# EAGLE design Felderblock_Grundplatine (EAGLE 7.7.0)
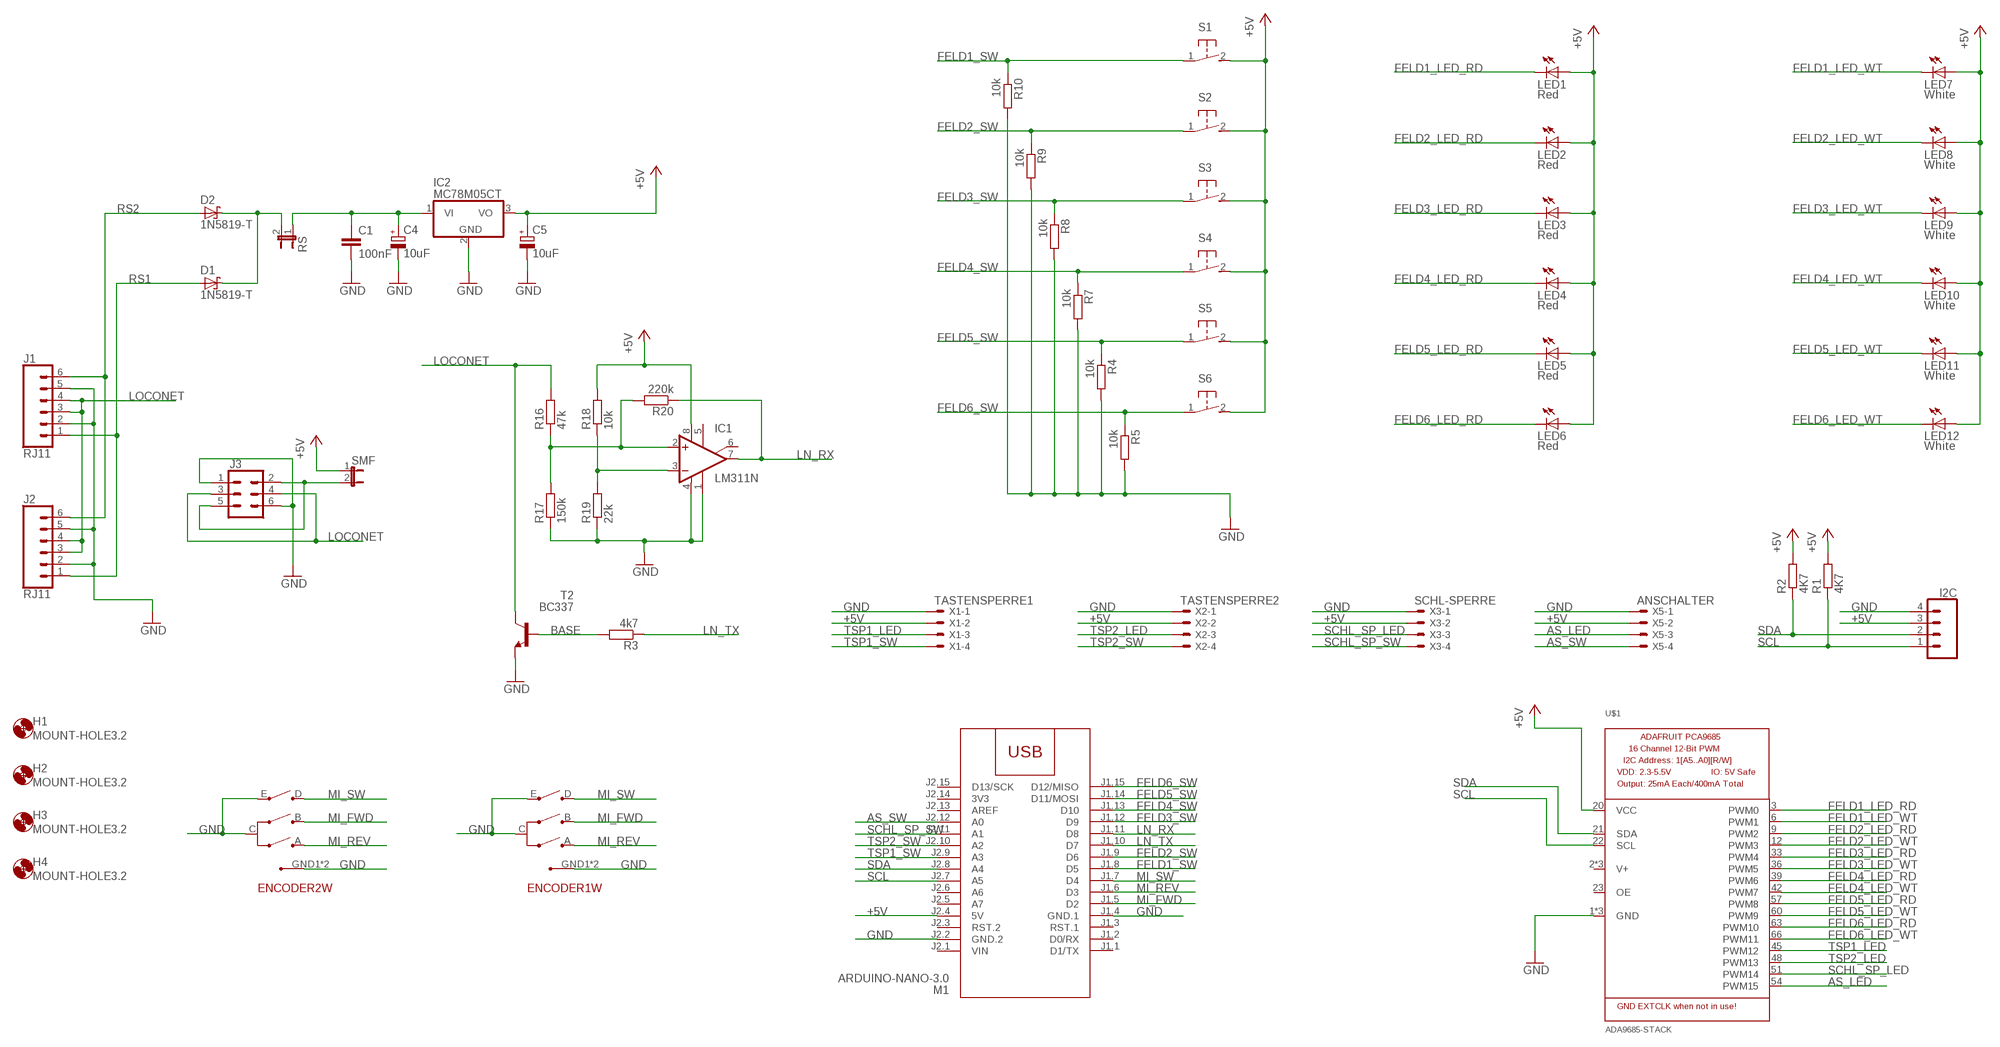
[diagram p0: schematic, sheet 1]

## Parts
C1  100nF  C-EU025-025X050  [C025-025X050]
C4  10uF  CPOL-EUE2-5  [E2-5]
C5  10uF  CPOL-EUE2-5  [E2-5]
D1  1N5819-T  [DO41-7.6]
D2  1N5819-T  [DO41-7.6]
ENCODER1  EC11B42AE  [EC11B42]
ENCODER2  EC11B42AE  [EC11B42]
H1  MOUNT-HOLE3.2  [3,2]
H2  MOUNT-HOLE3.2  [3,2]
H3  MOUNT-HOLE3.2  [3,2]
H4  MOUNT-HOLE3.2  [3,2]
I2C  CONN_04JST-PTH-VERT  [JST-4-PTH-VERT]
IC1  LM311N  [DIL08]
IC2  MC78M05CT  [TO220V]
J1  RJ11  RJ11-6  [RJ11-6]
J2  RJ11  RJ11-6  [RJ11-6]
J3  CONN_03X2SHROUD  [2X3-SHROUDED]
LED1  Red  LED3MM  [LED3MM]
LED2  Red  LED3MM  [LED3MM]
LED3  Red  LED3MM  [LED3MM]
LED4  Red  LED3MM  [LED3MM]
LED5  Red  LED3MM  [LED3MM]
LED6  Red  LED3MM  [LED3MM]
LED7  White  LED3MM  [LED3MM]
LED8  White  LED3MM  [LED3MM]
LED9  White  LED3MM  [LED3MM]
LED10  White  LED3MM  [LED3MM]
LED11  White  LED3MM  [LED3MM]
LED12  White  LED3MM  [LED3MM]
M1  ARDUINO-NANO-3.0  [ARDUINO-NANO-3.0]
R1  4K7  R-EU_0207/7  [0207/7]
R2  4K7  R-EU_0207/7  [0207/7]
R3  4k7  R-EU_0207/7  [0207/7]
R4  10k  R-EU_0207/7  [0207/7]
R5  10k  R-EU_0207/7  [0207/7]
R7  10k  R-EU_0207/7  [0207/7]
R8  10k  R-EU_0207/7  [0207/7]
R9  10k  R-EU_0207/7  [0207/7]
R10  10k  R-EU_0207/7  [0207/7]
R16  47k  R-EU_0207/7  [0207/7]
R17  150k  R-EU_0207/7  [0207/7]
R18  10k  R-EU_0207/7  [0207/7]
R19  22k  R-EU_0207/7  [0207/7]
R20  220k  R-EU_0207/7  [0207/7]
RS  JP1E  [JP1]
S1  31-XX  [B3F-31XX]
S2  31-XX  [B3F-31XX]
S3  31-XX  [B3F-31XX]
S4  31-XX  [B3F-31XX]
S5  31-XX  [B3F-31XX]
S6  31-XX  [B3F-31XX]
SMF  JP1E  [JP1]
T2  BC337  [TO92]
U$1  ADA9685-STACK  [ADA9685-STACK]
X1  TASTENSPERRE1  22-23-2041  [22-23-2041]
X2  TASTENSPERRE2  22-23-2041  [22-23-2041]
X3  SCHL-SPERRE  22-23-2041  [22-23-2041]
X5  ANSCHALTER  22-23-2041  [22-23-2041]

## Nets
+5V: C5.+ I2C.3 IC1.8(V+) IC2.3(VO) LED1.A LED2.A LED3.A LED4.A LED5.A LED6.A LED7.A LED8.A LED9.A LED10.A LED11.A LED12.A M1.J2.4(5V) R1.2 R2.2 R18.2 S1.2(S) S2.2(S) S3.2(S) S4.2(S) S5.2(S) S6.2(S) SMF.1 U$1.20(VCC) X1.2 X2.2 X3.2 X5.2
AS_LED: U$1.54(PWM15) X5.3
AS_SW: M1.J2.12(A0) X5.4
BASE: R3.2 T2.2(B)
FELD1_LED_RD: LED1.K(C) U$1.3(PWM0)
FELD1_LED_WT: LED7.K(C) U$1.6(PWM1)
FELD1_SW: M1.J1.8(D5) R10.1 S1.1(P)
FELD2_LED_RD: LED2.K(C) U$1.9(PWM2)
FELD2_LED_WT: LED8.K(C) U$1.12(PWM3)
FELD2_SW: M1.J1.9(D6) R9.1 S2.1(P)
FELD3_LED_RD: LED3.K(C) U$1.33(PWM4)
FELD3_LED_WT: LED9.K(C) U$1.36(PWM5)
FELD3_SW: M1.J1.12(D9) R8.1 S3.1(P)
FELD4_LED_RD: LED4.K(C) U$1.39(PWM6)
FELD4_LED_WT: LED10.K(C) U$1.42(PWM7)
FELD4_SW: M1.J1.13(D10) R7.1 S4.1(P)
FELD5_LED_RD: LED5.K(C) U$1.57(PWM8)
FELD5_LED_WT: LED11.K(C) U$1.60(PWM9)
FELD5_SW: M1.J1.14(D11/MOSI) R4.1 S5.1(P)
FELD6_LED_RD: LED6.K(C) U$1.63(PWM10)
FELD6_LED_WT: LED12.K(C) U$1.66(PWM11)
FELD6_SW: M1.J1.15(D12/MISO) R5.1 S6.1(P)
GND: C1.2 C4.- C5.- ENCODER1.C(W:C) ENCODER1.E ENCODER1.GND1(W:GND) ENCODER1.GND2(W:GND) ENCODER2.C(W:C) ENCODER2.E ENCODER2.GND1(W:GND) ENCODER2.GND2(W:GND) I2C.4 IC1.1(GND) IC1.4(V-) IC2.2(GND) J1.2 J1.5 J2.2 J2.5 J3.1 J3.6 M1.J1.4(GND.1) M1.J2.2(GND.2) R4.2 R5.2 R7.2 R8.2 R9.2 R10.2 R17.1 R19.1 T2.1(E) U$1.1(GND) U$1.24(GND) U$1.52(GND) X1.1 X2.1 X3.1 X5.1
LN_RX: IC1.7(OUT) M1.J1.11(D8) R20.1
LN_TX: M1.J1.10(D7) R3.1
LOCONET: J1.3 J1.4 J2.3 J2.4 J3.3 J3.4 R16.2 T2.3(C)
MI_FWD: ENCODER1.B(W:B) ENCODER2.B(W:B) M1.J1.5(D2)
MI_REV: ENCODER1.A(W:A) ENCODER2.A(W:A) M1.J1.6(D3)
MI_SW: ENCODER1.D ENCODER2.D M1.J1.7(D4)
N$5: IC1.2(+IN) R16.1 R17.2 R20.2
N$6: D1.C D2.C RS.2
N$7: C1.1 C4.+ IC2.1(VI) RS.1
N$8: IC1.3(-IN) R18.1 R19.2
N$10: J3.2 J3.5 SMF.2
RS1: D1.A J1.1 J2.1
RS2: D2.A J1.6 J2.6
SCHL_SP_LED: U$1.51(PWM14) X3.3
SCHL_SP_SW: M1.J2.11(A1) X3.4
SCL: I2C.1 M1.J2.7(A5) R1.1 U$1.22(SCL)
SDA: I2C.2 M1.J2.8(A4) R2.1 U$1.21(SDA)
TSP1_LED: U$1.45(PWM12) X1.3
TSP1_SW: M1.J2.9(A3) X1.4
TSP2_LED: U$1.48(PWM13) X2.3
TSP2_SW: M1.J2.10(A2) X2.4
Unconnected: IC1.5(ON) IC1.6(ON/STR) M1.J1.1(D1/TX) M1.J1.2(D0/RX) M1.J1.3(RST.1) M1.J2.3(RST.2) M1.J2.5(A7) M1.J2.6(A6) M1.J2.13(AREF) M1.J2.15(D13/SCK) U$1.2(V+) U$1.19(V+) U$1.23(OE) U$1.53(V+)

## Power pins joined to a net without a drawn wire
3V3: M1.J2.14(3V3)
VIN: M1.J2.1(VIN)

## Library data of the parts
C1 = resistor:C-EU: CAPACITOR, European symbol
C4 C5 = resistor:CPOL-EU: POLARIZED CAPACITOR, European symbol
D1 D2 = diode:1N581*: 1.0A SCHOTTKY BARRIER RECTIFIER Source: http://www.diodes.com/datasheets/ds23001.pdf
ENCODER1 ENCODER2 = alps:EC11B42AE: EC11B42 Encoder/switch
H1-H4 = holes:MOUNT-HOLE: MOUNTING HOLE with drill center marker
I2C = SparkFun-Connectors:CONN_04: Multi connection point. Often used as Generic Header-pin footprint for 0.1 inch spaced/style header connections On any of the 0.1 inch spaced packages, you can populate with these: Break Away Headers - Straight <https://www.sparkfun.com/products/116> (PRT-00116) Break Away Male Headers - Right Angle <https://www.sparkfun.com/products/553> (PRT-00553) Female Headers <https://www.sparkfun.com/products/115> (PRT-00115) Break Away Headers - Machine Pin <https://www.sparkfun.com/products/117> (PRT-00117) Break Away Female Headers - Swiss Machine Pin <https://www.sparkfun.com/products/743> (PRT-00743) For SCREWTERMINALS and SPRING TERMINALS visit here: Screw Terimnals on SparkFun.com <https://www.sparkfun.com/search/results?term=Screw+Terminals> (5mm/3.5mm/2.54mm spacing) This device is also useful as a general connection point to wire up your design to another part of your project. Our various solder wires solder well into these plated through hole pads. Hook-Up Wire - Assortment (Stranded, 22 AWG) <https://www.sparkfun.com/products/11375> (PRT-11375) Hook-Up Wire - Assortment (Solid Core, 22 AWG) <https://www.sparkfun.com/products/11367> (PRT-11367) View the entire wire category on our website here <https://www.sparkfun.com/categories/141> Special notes: Molex polarized connector foot print use with SKU : PRT-08231 with associated crimp pins and housings. 1MM SMD Version SKU: PRT-10208; PROD_ID: CONN-13251
IC1 = linear:LM311: COMPARATOR
IC2 = linear:MC78M: 500 mA Positive Voltage Regulators Source: Data sheet <http://www.onsemi.com/pub_link/Collateral/MC78M00-D.PDF>
J1 J2 = SparkFun-Connectors:RJ11-6: RJ11 Jack - 6 pin Commonly found on CAT3 devices and some Microchip programmers. Here is the connector we sell at SparkFun: RJ11 6-Pin Connector <https://www.sparkfun.com/products/132> (PRT-00132) Datasheet <http://www.sparkfun.com/datasheets/Prototyping/Connectors/RJ11-Datasheet.pdf> It is used on this SparkFun product: SparkFun Weather Shield <https://www.sparkfun.com/products/12081> (DEV-12081) Weather Meters <https://www.sparkfun.com/products/8942> (SEN-08942); PROD_ID: CONN-08590; SF_ID: PRT-00132
J3 = SparkFun-Connectors:CONN_03X2: Multi connection point. Often used as Generic Header-pin footprint for 0.1 inch spaced/style header connections You can populate with any combo of single row headers, but if you'd like an exact match, check these: Header - 2x3 (Male, 0.1") <https://www.sparkfun.com/products/12807> (PRT-12807) Header - 2x3 (Female, 0.1") <https://www.sparkfun.com/products/13010> (PRT-13010) 2x3 Pin Shrouded Header <https://www.sparkfun.com/products/10877> (PRT-10877) On any of the 0.1 inch spaced packages, you can populate with these: Break Away Headers - Straight <https://www.sparkfun.com/products/116> (PRT-00116) Break Away Male Headers - Right Angle <https://www.sparkfun.com/products/553> (PRT-00553) Female Headers <https://www.sparkfun.com/products/115> (PRT-00115) Break Away Headers - Machine Pin <https://www.sparkfun.com/products/117> (PRT-00117) Break Away Female Headers - Swiss Machine Pin <https://www.sparkfun.com/products/743> (PRT-00743) Special note: the shrouded connector mates well with our 3x2 ribbon cables: Ribbon Crimp Connector - 6-pin (2x3, Female) <https://www.sparkfun.com/products/10651> (PRT-10651) Ribbon Cable - 6 wire (15ft) <https://www.sparkfun.com/products/10646> (PRT-10646); PROD_ID: CONN-10681; SF_ID: PRT_10877
LED1-LED12 = led:LED: LED OSRAM: - CHIPLED LG R971, LG N971, LY N971, LG Q971, LY Q971, LO R971, LY R971 LH N974, LH R974 LS Q976, LO Q976, LY Q976 LO Q996 - Hyper CHIPLED LW Q18S LB Q993, LB Q99A, LB R99A - SideLED LS A670, LO A670, LY A670, LG A670, LP A670 LB A673, LV A673, LT A673, LW A673 LH A674 LY A675 LS A676, LA A676, LO A676, LY A676, LW A676 LS A679, LY A679, LG A679 - Hyper Micro SIDELED® LS Y876, LA Y876, LO Y876, LY Y876 LT Y87S - SmartLED LW L88C, LW L88S LB L89C, LB L89S, LG L890 LS L89K, LO L89K, LY L89K LS L896, LA L896, LO L896, LY L896 - TOPLED LS T670, LO T670, LY T670, LG T670, LP T670 LSG T670, LSP T670, LSY T670, LOP T670, LYG T670 LG T671, LOG T671, LSG T671 LB T673, LV T673, LT T673, LW T673 LH T674 LS T676, LA T676, LO T676, LY T676, LB T676, LH T676, LSB T676, LW T676 LB T67C, LV T67C, LT T67C, LS T67K, LO T67K, LY T67K, LW E67C LS E67B, LA E67B, LO E67B, LY E67B, LB E67C, LV E67C, LT E67C LW T67C LS T679, LY T679, LG T679 LS T770, LO T770, LY T770, LG T770, LP T770 LB T773, LV T773, LT T773, LW T773 LH T774 LS E675, LA E675, LY E675, LS T675 LS T776, LA T776, LO T776, LY T776, LB T776 LHGB T686 LT T68C, LB T68C - Hyper Mini TOPLED® LB M676 - Mini TOPLED Santana® LG M470 LS M47K, LO M47K, LY M47K Source: http://www.osram.convergy.de LUXEON: - LUMILED® LXK2-PW12-R00, LXK2-PW12-S00, LXK2-PW14-U00, LXK2-PW14-V00 LXK2-PM12-R00, LXK2-PM12-S00, LXK2-PM14-U00 LXK2-PE12-Q00, LXK2-PE12-R00, LXK2-PE12-S00, LXK2-PE14-T00, LXK2-PE14-U00 LXK2-PB12-K00, LXK2-PB12-L00, LXK2-PB12-M00, LXK2-PB14-N00, LXK2-PB14-P00, LXK2-PB14-Q00 LXK2-PR12-L00, LXK2-PR12-M00, LXK2-PR14-Q00, LXK2-PR14-R00 LXK2-PD12-Q00, LXK2-PD12-R00, LXK2-PD12-S00 LXK2-PH12-R00, LXK2-PH12-S00 LXK2-PL12-P00, LXK2-PL12-Q00, LXK2-PL12-R00 Source: www.luxeon.com KINGBRIGHT: KA-3528ASYC Source: www.kingbright.com
M1 = diy-modules:ARDUINO-NANO-3.0: Arduino Nano 3.0
R1-R5 R7-R10 R16-R20 = resistor:R-EU_: RESISTOR, European symbol
RS SMF = jumper:JP1E: JUMPER
S1-S6 = adafruit:31-XX: OMRON SWITCH Now with beefier pads!
T2 = transistor:BC337: NPN TRANSISTOR
U$1 = ada9685:ADA9685-STACK
X1-X3 X5 = con-molex:22-23-2041: .100" (2.54mm) Center Header - 4 Pin; MF: MOLEX; MPN: 22-23-2041; OC_FARNELL: 1462920; OC_NEWARK: 38C0355

## Board
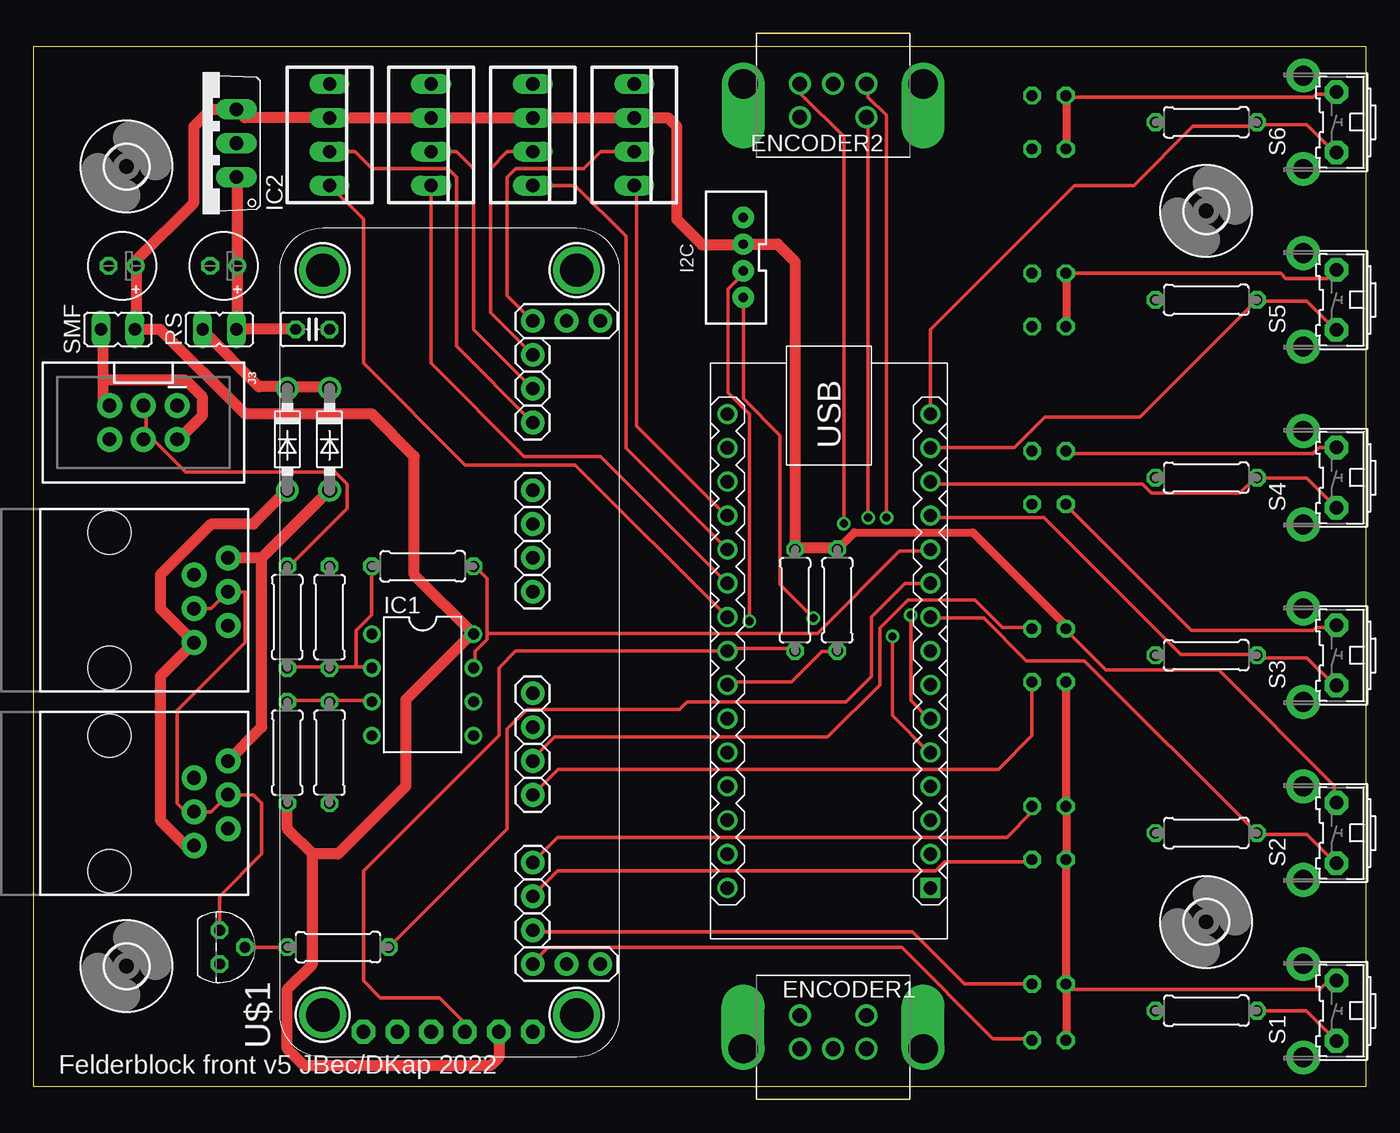
[diagram p1: board, top side]
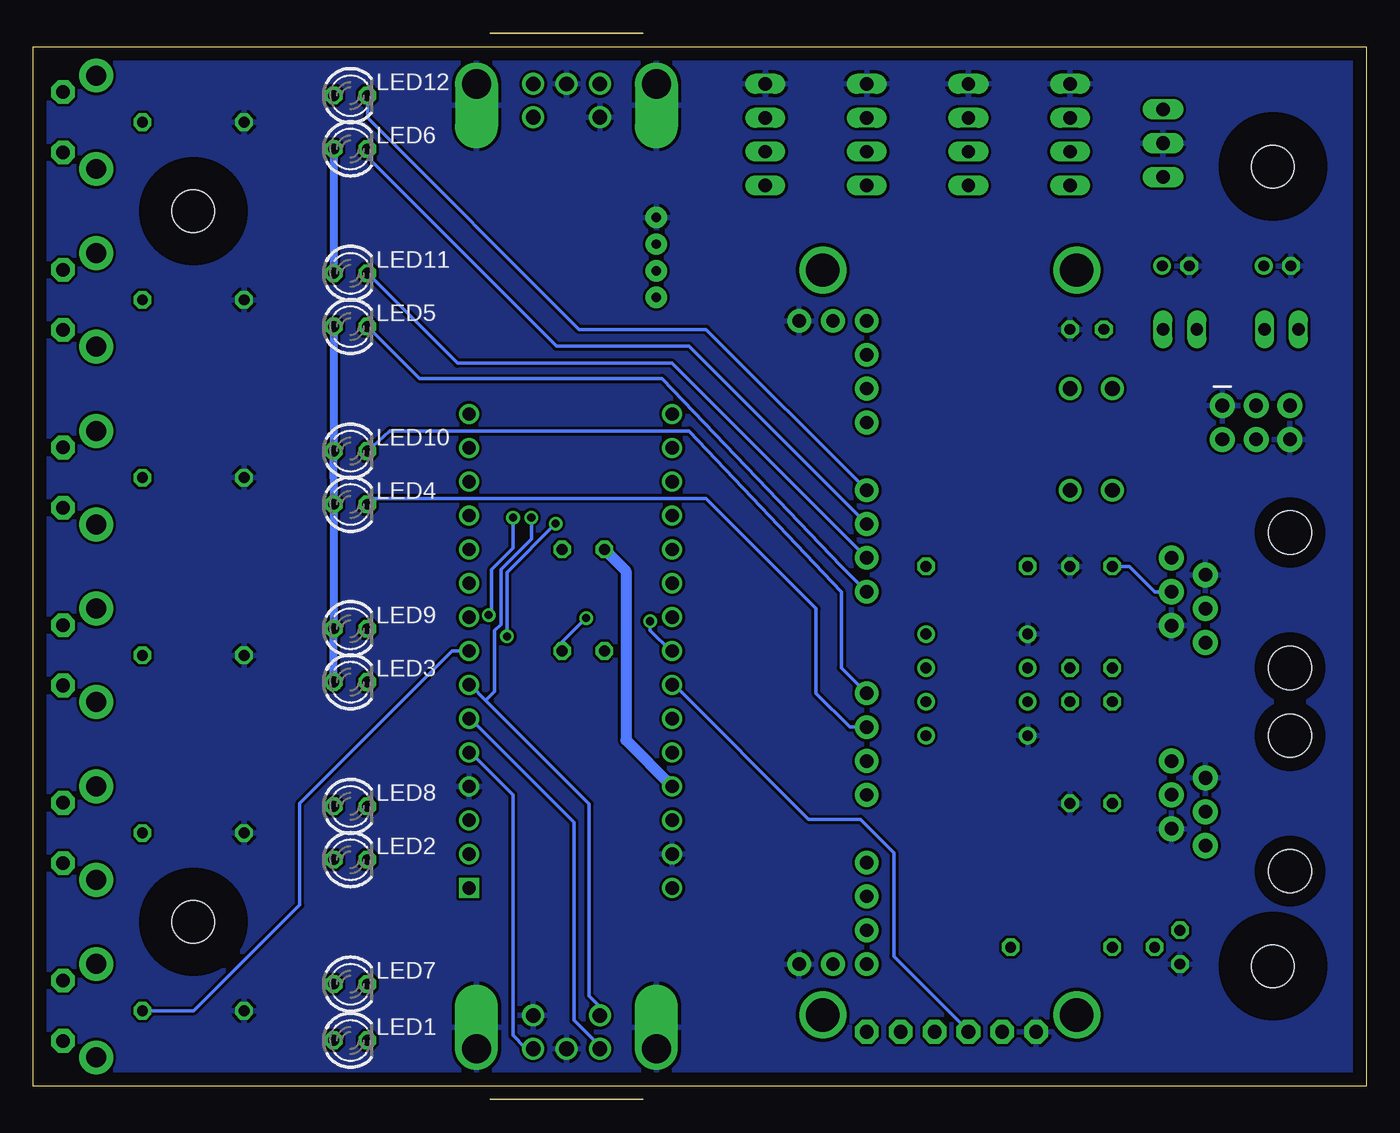
[diagram p2: board, bottom side, seen from below]

Size 100 x 78 mm. Coordinates in mm from the lower left corner, seen from the top.
Outline: 0,0 100,0 100,78 0,78 0,0
Copper layers (1*16): Top 0.035mm / dielectric 1.5mm / Bottom 0.035mm
Design rules "default": minimum track width 10mil, minimum drill 24mil, track to track 8mil, track to pad 8mil, pad to pad 8mil, via to via 8mil, smd to smd 8mil, copper to edge 40mil, drill to drill 8mil, minimum pad ring 10mil, minimum via ring 8mil, stop-mask expansion 4mil, vias tented up to drill 0mil, thermal gap 10mil

### Footprints (pad centres in the part's own frame; a part is rotated, then mirrored left to right if it is on the bottom)
C025-025X050 = drill 0.813 octagon: 1 -1.27,0; 2 1.27,0
E2-5 = drill 0.813 pad 1.27: + -1.016,0 | drill 0.813 pad 1.27 octagon: - 1.016,0
DO41-7.6 = drill 1.1 pad 1.7: A 3.81,0; C -3.81,0
EC11B42 = drill 1.1: A -2.5,0; B 2.5,0; C 0,0; D -2.5,2.5; E 2.5,2.5 | drill 2.2 offset: GND1 -6.75,0; GND2 6.75,0
3,2 = hole 3.2: 0,0
JST-4-PTH-VERT = drill 0.7 pad 1.6: 1 -3,-0.55; 2 -1,-0.55; 3 1,-0.55; 4 3,-0.55
DIL08 = drill 0.813 pad 1.27: 1 -3.81,-3.81; 2 -1.27,-3.81; 3 1.27,-3.81; 4 3.81,-3.81; 5 3.81,3.81; 6 1.27,3.81; 7 -1.27,3.81; 8 -3.81,3.81
TO220V = drill 1.016 long: 1 -2.54,-2.54; 2 0,-2.54; 3 2.54,-2.54
RJ11-6 = drill 1.016 pad 1.88: 1 -3.175,8.89; 2 -1.905,6.35; 3 -0.635,8.89; 4 0.635,6.35; 5 1.905,8.89; 6 3.175,6.35 | hole 3.251: -5.08,0; 5.08,0
2X3-SHROUDED = drill 1.016 pad 1.88: 1 -1.27,2.54; 2 1.27,2.54; 3 -1.27,0; 4 1.27,0; 5 -1.27,-2.54; 6 1.27,-2.54
LED3MM = drill 0.813 octagon: A -1.27,0; K 1.27,0
ARDUINO-NANO-3.0 = drill 1 square: J1.1 17.78,7.62 | drill 1: J1.2 15.24,7.62; J1.3 12.7,7.62; J1.4 10.16,7.62; J1.5 7.62,7.62; J1.6 5.08,7.62; J1.7 2.54,7.62; J1.8 0,7.62; J1.9 -2.54,7.62; J1.10 -5.08,7.62; J1.11 -7.62,7.62; J1.12 -10.16,7.62; J1.13 -12.7,7.62; J1.14 -15.24,7.62; J1.15 -17.78,7.62; J2.1 17.78,-7.62; J2.2 15.24,-7.62; J2.3 12.7,-7.62; J2.4 10.16,-7.62; J2.5 7.62,-7.62; J2.6 5.08,-7.62; J2.7 2.54,-7.62; J2.8 0,-7.62; J2.9 -2.54,-7.62; J2.10 -5.08,-7.62; J2.11 -7.62,-7.62; J2.12 -10.16,-7.62; J2.13 -12.7,-7.62; J2.14 -15.24,-7.62; J2.15 -17.78,-7.62
0207/7 = drill 0.813 octagon: 1 -3.81,0; 2 3.81,0
JP1 = drill 0.914 long: 1 0,-1.27; 2 0,1.27
B3F-31XX = drill 1.016 pad 1.778 octagon: 1 -2.261,-1.245; 2 2.261,-1.245 | drill 1.499 pad 2.54: 3 -3.505,1.245; 4 3.505,1.245
TO92 = drill 0.813 octagon: 1 1.27,0; 2 0,1.905; 3 -1.27,0
ADA9685-STACK = drill 1 pad 1.778: 1 5.08,-5.08; 2 5.08,-2.54; 3 5.08,0; 6 7.62,0; 9 10.16,0; 12 12.7,0; 33 17.78,0; 36 20.32,0; 39 22.86,0; 42 25.4,0; 45 45.72,0; 48 48.26,0; 51 50.8,0; 52 53.34,-5.08; 53 53.34,-2.54; 54 53.34,0; 57 33.02,0; 60 35.56,0; 63 38.1,0; 66 40.64,0 | drill 1.016 pad 1.778 octagon: 19 0,0; 20 0,2.54; 21 0,5.08; 22 0,7.62; 23 0,10.16; 24 0,12.7 | drill 2.5 pad 3.2: P$1 1.27,-3.302; P$2 1.27,15.748; P$3 57.15,-3.302; P$4 57.15,15.748
22-23-2041 = drill 1 long: 1 -3.81,0; 2 -1.27,0; 3 1.27,0; 4 3.81,0

### Placement (x,y rotation side)
C1  20.95,56.78 0 top
C4  14.29,61.55 180 top
C5  6.67,61.55 180 top
D1  22.23,48.53 270 top
D2  19.05,48.53 270 top
ENCODER1  60,2.81 0 top
ENCODER2  60,75.2 180 top
H1  88,12.33 0 top
H2  7,9 0 top
H3  7,69 0 top
H4  88,65.66 0 top
I2C  52.7,62.18 90 top
IC1  29.21,30.11 270 top
IC2  12.7,70.75 90 top
J1  5.71,21.23 270 top
J2  5.71,36.47 270 top
J3  8.26,49.8 270 top
LED1  76.2,3.44 0 bottom
LED2  76.2,17 0 bottom
LED3  76.2,30.33 0 bottom
LED4  76.2,43.66 0 bottom
LED5  76.2,57 0 bottom
LED6  76.2,70.33 0 bottom
LED7  76.2,7.66 0 bottom
LED8  76.2,21 0 bottom
LED9  76.2,34.33 0 bottom
LED10  76.2,47.66 0 bottom
LED11  76.2,61 0 bottom
LED12  76.2,74.33 0 bottom
M1  59.69,32.66 270 top
R1  60.33,36.47 90 top
R2  57.15,36.47 90 top
R3  22.86,10.43 180 top
R4  88,59 180 top
R5  88,72.33 180 top
R7  88,45.66 180 top
R8  88,32.33 180 top
R9  88,19 180 top
R10  88,5.66 180 top
R16  19.05,35.2 90 top
R17  22.23,35.2 270 top
R18  19.05,25.04 270 top
R19  22.23,25.04 90 top
R20  29.21,39.01 180 top
RS  13.97,56.78 90 top
S1  96.52,5.66 90 top
S2  96.52,19 90 top
S3  96.52,32.33 90 top
S4  96.52,45.66 90 top
S5  96.52,59 90 top
S6  96.52,72.33 90 top
SMF  6.35,56.78 90 top
T2  13.97,10.43 270 top
U$1  37.47,4.08 90 top
X1  22.23,71.39 270 top
X2  29.84,71.39 270 top
X3  37.47,71.39 270 top
X5  45.09,71.39 270 top

### Tracks (layer width: path | path; a pad name or v marks a point on that pad's centre or on a via)
+5V  (via drill 0.6)
  Top 0.254: 7.77,61.41 C5.+ | 7.77,56.84 SMF.1 7.77,56.61 | 32.92,33.98 IC1.8 | 77.5,17.06 LED2.A 77.5,16.83 | 77.5,20.95 LED8.A | 77.5,3.57 LED1.A | 77.5,7.46 LED7.A | 77.5,7.69 LED7.A | S2.2 97.61,21.4 97.61,22.55 88.92,31.23 80.47,31.23 77.5,34.2 LED9.A 77.47,34.56 | 77.5,70.55 LED6.A | S6.2 97.61,74.44 96.24,74.44 96.01,74.21 77.5,74.21 LED12.A | 77.5,57.06 LED5.A | 77.5,60.95 LED11.A 93.58,61 93.98,60.59 97.1,60.59 S5.2 | S3.2 97.61,34.43 96.24,34.43 96.01,34.2 86.87,34.2 77.5,43.58 LED4.A | S4.2 97.61,47.92 96.47,47.92 96.01,47.46 77.67,47.46 LED10.A | 60.12,40.38 R1.2 | 57.15,40.38 R2.2 | S1.2 97.19,7.92 96.52,7.26 77.88,7.26 LED7.A
  Top 0.61: 77.5,20.95 77.5,17.06 | 77.5,7.46 77.5,3.57 | 77.5,7.69 77.5,16.83 | 77.5,74.21 77.5,70.55 | 77.5,60.95 77.5,57.06 | v77.47,30.29 LED8.A | 77.47,34.56 70.48,41.55 61.59,41.55 R1.2 | C5.+ 7.68,61.93
  Top 0.813: 7.77,56.84 7.77,61.41 | U$1.20 34.92,2.17 34.29,1.54 20.32,1.54 19.05,2.81 19.05,7.26 20.95,9.16 20.95,17.41 | 20.95,17.41 19.05,19.32 R18.2 | 32.92,33.98 27.94,29 27.94,22.5 22.86,17.41 20.95,17.41 | IC1.8 28.57,38.37 28.57,47.26 25.4,50.44 15.88,50.44 9.53,56.78 SMF.1 | 7.68,61.93 12.06,66.31 12.06,72.03 13.34,73.3 IC2.3 15.88,72.66 X1.2 X2.2 X3.2 X5.2 47.62,72.66 48.26,72.03 48.26,65.04 50.16,63.14 53.21,63.14 I2C.3 55.83,63.18 57.15,61.87 57.15,40.38 60.12,40.38
  Bottom 0.254: 77.47,30.34 77.5,30.32 v77.47,30.29 | LED3.A 77.5,30.55 77.47,30.55 | 77.5,47.46 77.27,47.46 LED10.A
  Bottom 0.61: LED6.A LED11.A | 77.5,47.46 LED4.A LED9.A 77.47,30.55 77.47,30.34 | LED5.A LED10.A
  Bottom 0.813: M1.J2.4 55.55,25.98 55.55,38.67 R2.2
AS_LED
  Top 0.254: U$1.54 35.56,59.33 35.56,68.22 36.2,68.85 41.27,68.85 42.55,70.12 X5.3
AS_SW
  Top 0.254: X5.4 45.26,67.58 45.26,49.52 51.89,42.89 M1.J2.12
BASE
  Top 0.254: R3.2 T2.2
FELD1_LED_RD
  Top 0.254: LED1.K 74.75,3.57 72.01,3.57 65.15,10.43 38.63,10.43 37.49,9.29 U$1.3
FELD1_LED_WT
  Top 0.254: LED7.K 74.75,7.69 69.85,7.69 65.96,11.57 37.49,11.57 U$1.6
FELD1_SW
  Top 0.254: R10.1 95.5,5.66 S1.1
  Bottom 0.254: R10.1 87.95,5.66 80.01,13.61 80.01,21.23 68.58,32.66 M1.J1.8
FELD2_LED_RD
  Top 0.254: LED2.K 74.75,16.83 68.35,16.83 67.67,16.14 39.32,16.14 37.49,14.32 U$1.9
FELD2_LED_WT
  Top 0.254: LED8.K 74.93,20.59 73.03,18.68 39.34,18.68 37.49,16.83 U$1.12
FELD2_SW
  Top 0.254: S2.1 97.61,16.83 95.56,18.89 91.9,18.89 R9.1 91.67,19.12 78.87,31.92 74.52,31.92 71.32,35.12 67.44,35.12 M1.J1.9
FELD3_LED_RD
  Top 0.254: U$1.33 39.37,23.77 72.39,23.77 74.93,26.3 LED3.K
FELD3_LED_WT
  Top 0.254: LED9.K 74.75,34.43 72.69,34.43 70.64,36.49 65.61,36.49 63.5,34.38 63.5,30.11 59.59,26.2 39.09,26.2 37.49,24.6 U$1.36
FELD3_SW
  Top 0.254: S3.1 97.61,30.09 95.56,32.15 91.9,32.15 R8.1 91.67,32.38 86.11,32.38 75.82,42.66 67.44,42.66 M1.J1.12
FELD4_LED_RD
  Bottom 0.254: U$1.39 38.73,26.94 41.27,29.48 41.27,35.83 49.53,44.09 74.5,44.09 LED4.K
FELD4_LED_WT
  Bottom 0.254: LED10.K 73.26,49.16 50.8,49.16 39.37,37.1 39.37,31.38 U$1.42
FELD4_SW
  Top 0.254: S4.1 97.61,43.58 95.56,45.63 91.9,45.63 R7.1 91.67,45.63 90.53,44.49 83.9,44.49 83.21,45.18 67.44,45.18 M1.J1.13
FELD5_LED_RD
  Bottom 0.254: 37.49,36.95 U$1.57 39.37,39.01 52.83,53.1 71.03,53.1 LED5.K
FELD5_LED_WT
  Bottom 0.254: U$1.60 52.07,54.24 68.17,54.24 LED11.K
FELD5_SW
  Top 0.254: S5.1 97.61,56.84 95.56,58.89 91.9,58.89 R4.1 83.02,50.21 75.89,50.21 73.61,47.92 67.44,47.92 M1.J1.14
FELD6_LED_RD
  Bottom 0.254: U$1.63 50.8,55.52 60.75,55.52 74.93,69.69 LED6.K
FELD6_LED_WT
  Bottom 0.254: U$1.66 49.53,56.78 59.05,56.78 74.93,72.66 LED12.K
FELD6_SW
  Top 0.254: S6.1 97.61,70.09 95.56,72.15 91.9,72.15 R5.1 91.5,72.03 87,72.03 82.55,67.58 78.11,67.58 67.31,56.78 M1.J1.15
GND
  pour Bottom: 0,0.27 100.33,0.27 100.33,77.74 0,77.74
LN_RX
  Top 0.254: 34.06,33.98 34.06,38.09 33.15,39.01 R20.1 | 34.06,33.98 34.06,33.52 33.15,32.6 33.15,31.46 IC1.7 | 34.06,33.98 58.83,33.98 65,40.15 67.21,40.15 M1.J1.11
LN_TX
  Top 0.254: R3.1 35.56,19.32 35.56,26.79 37.03,28.26 48.46,28.26 49.05,28.84 60.96,28.84 62.87,30.75 62.87,35.2 65.41,37.73 M1.J1.10
  Bottom 0.254: 26.75,10.43 R3.1
LOCONET
  Top 0.254: J3.3 8.46,50.89 8.46,48.61 J3.4 8.46,48.38 9.14,48.38 11.43,46.09 22.63,46.09 23.55,45.18 23.55,43.35 19.2,39.01 R16.2 | J2.4 13.34,35.83 J2.3 15.88,37.1 15.88,33.29 10.79,28.21 10.79,21.23 11.43,20.59 J1.4 13.34,20.59 J1.3 16.51,21.86 17.14,21.23 17.14,17.41 13.97,14.24 T2.3
  Bottom 0.254: R16.2 17.78,39.01 15.88,37.1 J2.3
MI_FWD  (via drill 0.61)
  Top 0.254: v60.81,42.2 60.81,71.24 57.61,74.44 57.61,75.12 ENCODER2.B | v64.47,33.75 64.47,27.8 67.21,25.06 M1.J1.5
  Bottom 0.254: M1.J1.5 67.21,24.83 66.98,24.83 64.01,21.86 64.01,3.8 63.09,2.89 62.64,2.89 ENCODER1.B | v60.81,42.2 64.47,38.55 v64.47,33.75
MI_REV  (via drill 0.61)
  Top 0.254: v64.01,42.66 64.01,72.84 62.64,74.21 62.64,75.12 ENCODER2.A | v65.84,35.35 65.84,28.95 67.21,27.57 M1.J1.6
  Bottom 0.254: M1.J1.6 67.21,27.57 59.44,19.8 59.44,4.94 57.38,2.89 ENCODER1.A | v64.01,42.66 64.01,40.38 65.61,38.78 65.61,35.58 v65.84,35.35
MI_SW  (via drill 0.61)
  Top 0.254: v62.64,42.66 62.64,72.61 ENCODER2.D
  Bottom 0.254: 66.06,28.95 58.29,21.17 58.29,6.77 57.61,6.09 57.61,5.4 ENCODER1.D | 66.06,28.95 67.21,30.09 M1.J1.7 | v62.64,42.66 62.64,41.06 64.92,38.78 64.92,34.66 65.38,34.2 65.38,29.63 66.06,28.95
N$5
  Top 0.254: R16.1 19.2,31.46 22.17,31.46 R17.2 22.4,31.46 24.23,31.46 | 24.23,31.46 25.38,31.46 IC1.2 | 24.23,31.46 24.23,34.2 25.38,35.35 25.38,39.01 R20.2
N$6
  Top 0.254: 12.8,56.61 RS.2 | 18.97,52.49 D2.C 19.2,52.49 | 22.17,52.49 D1.C
  Top 0.813: 12.8,56.61 16.92,52.49 18.97,52.49 | 19.2,52.49 22.17,52.49
N$7
  Top 0.254: 19.66,56.84 C1.1 | 15.32,61.41 C4.+ 15.32,61.64 | 15.32,56.84 RS.1 | 15.32,68.04 IC2.1
  Top 0.813: 19.66,56.84 15.32,56.84 15.32,61.41 | 15.32,61.64 15.32,68.04
N$8
  Top 0.254: R18.1 19.2,28.95 22.17,28.95 R19.2 22.4,28.95 25.38,28.95 IC1.3
N$10
  Top 0.254: 5.26,56.61 SMF.2 | 5.71,51.12 J3.5 | 10.97,48.61 J3.2
  Top 0.813: 5.26,52.98 5.26,51.58 5.71,51.12 | 5.26,52.98 5.26,56.61 | 10.97,48.61 12.7,50.33 12.7,51.7 11.43,52.98 5.26,52.98
RS1
  Top 0.813: D1.A 17.14,39.64 | 17.14,39.64 J2.1 | J1.1 17.14,26.94 17.14,39.64
RS2
  Top 0.813: D2.A 16.51,42.18 13.34,42.18 9.53,38.37 9.53,35.83 J2.6 9.53,30.75 9.53,19.95 11.43,18.05 J1.6
SCHL_SP_LED
  Top 0.254: U$1.51 34.29,58.05 34.29,68.85 35.56,70.12 X3.3
SCHL_SP_SW
  Top 0.254: M1.J2.11 44.45,47.9 44.45,63.77 40.64,67.58 X3.4
SCL  (via drill 0.61)
  Top 0.254: R1.1 60.12,32.6 59.16,32.6 56.87,30.32 52.12,30.32 M1.J2.7 | v58.52,35.12 56.01,37.63 56.01,48.84 53.26,51.58 53.26,59.12 I2C.1
  Bottom 0.254: U$1.22 29.95,4.26 35.43,9.74 35.43,17.52 37.95,20.03 41.83,20.03 51.89,30.09 M1.J2.7 | v58.52,35.12 60.35,33.29 60.35,32.83 R1.1
SDA  (via drill 0.61)
  Top 0.254: U$1.21 32.38,4.71 30.48,6.62 26.04,6.62 24.77,7.89 24.77,16.14 34.92,26.3 34.92,31.38 36.2,32.66 M1.J2.8 52.12,32.83 57.15,32.83 R2.1 | v53.72,34.89 53.72,50.44 52.12,52.03 52.12,59.81 53.03,60.72 53.03,61.18 I2C.2
  Bottom 0.254: v53.72,34.89 53.72,34.2 52.12,32.6 M1.J2.8
TSP1_LED
  Top 0.254: U$1.45 31.75,55.52 31.75,68.22 31.11,68.85 25.4,68.85 24.13,70.12 X1.3
TSP1_SW
  Top 0.254: M1.J2.9 40.64,46.62 32.38,46.62 24.77,54.24 24.77,65.04 X1.4
TSP2_LED
  Top 0.254: U$1.48 33.02,56.78 33.02,68.85 31.75,70.12 X2.3
TSP2_SW
  Top 0.254: M1.J2.10 42.55,47.26 36.83,47.26 29.84,54.24 X2.4

### Text on the board
tPlace: Felderblock front v5 JBec/DKap 2022